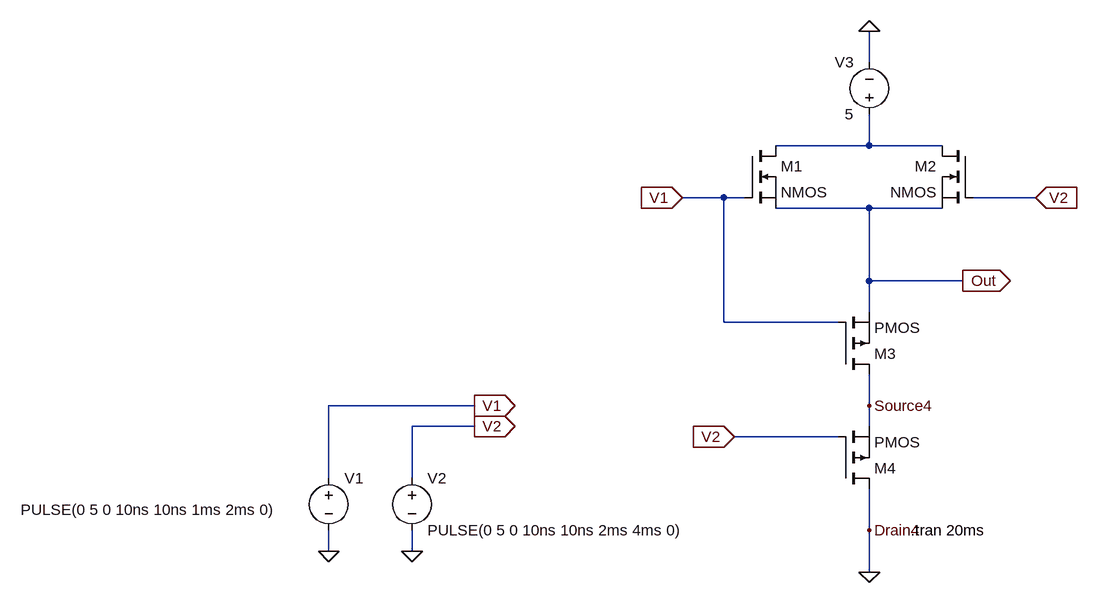
[diagram p0: schematic TP4_PORT_OR.asc]
TP4_PORT_OR.asc, the LTspice schematic file:
Version 4
SHEET 1 1088 756
WIRE 496 -256 496 -304
WIRE 496 -128 496 -176
WIRE 496 -128 352 -128
WIRE 608 -128 496 -128
WIRE 272 -48 208 -48
WIRE 304 -48 272 -48
WIRE 752 -48 656 -48
WIRE 496 -32 352 -32
WIRE 608 -32 496 -32
WIRE 496 80 496 -32
WIRE 640 80 496 80
WIRE 496 128 496 80
WIRE 272 144 272 -48
WIRE 448 144 272 144
WIRE -112 272 -336 272
WIRE 496 272 496 224
WIRE -112 304 -208 304
WIRE 496 304 496 272
WIRE 448 320 288 320
WIRE -336 384 -336 272
WIRE -208 384 -208 304
WIRE 496 464 496 400
WIRE -336 496 -336 464
WIRE -208 496 -208 464
WIRE 496 528 496 464
FLAG -336 496 0
FLAG -208 496 0
FLAG 496 -304 0
FLAG 496 528 0
FLAG 640 80 Out
IOPIN 640 80 Out
FLAG -112 272 V1
IOPIN -112 272 Out
FLAG -112 304 V2
IOPIN -112 304 Out
FLAG 208 -48 V1
IOPIN 208 -48 In
FLAG 752 -48 V2
IOPIN 752 -48 In
FLAG 288 320 V2
IOPIN 288 320 In
FLAG 496 272 Source4
FLAG 496 464 Drain4
SYMBOL voltage -336 368 R0
WINDOW 3 -474 64 Left 2
WINDOW 123 0 0 Left 0
WINDOW 39 0 0 Left 0
SYMATTR Value PULSE(0 5 0 10ns 10ns 1ms 2ms 0)
SYMATTR InstName V1
SYMBOL voltage -208 368 R0
WINDOW 123 0 0 Left 0
WINDOW 39 0 0 Left 0
SYMATTR InstName V2
SYMATTR Value PULSE(0 5 0 10ns 10ns 2ms 4ms 0)
SYMBOL voltage 496 -160 R180
WINDOW 0 24 96 Left 2
WINDOW 3 24 16 Left 2
WINDOW 123 0 0 Left 0
WINDOW 39 0 0 Left 0
SYMATTR InstName V3
SYMATTR Value 5
SYMBOL nmos 304 -128 R0
SYMATTR InstName M1
SYMBOL nmos 656 -128 M0
SYMATTR InstName M2
SYMBOL pmos 448 224 M180
SYMATTR InstName M3
SYMBOL pmos 448 400 M180
SYMATTR InstName M4
TEXT 560 464 Left 2 !.tran 20ms

The netlist it stands for:
* TP4_PORT_OR.asc
V1 V1 0 PULSE(0 5 0 10ns 10ns 1ms 2ms 0)
V2 V2 0 PULSE(0 5 0 10ns 10ns 2ms 4ms 0)
V3 N001 0 5
M1 N001 V1 Out Out NMOS
M2 N001 V2 Out Out NMOS
M3 Source4 V1 Out Out PMOS
M4 0 V2 Source4 Source4 PMOS
.model NMOS NMOS
.model PMOS PMOS
.lib standard.mos
.tran 20ms
.backanno
.end